# Altium project USB.PrjPcb
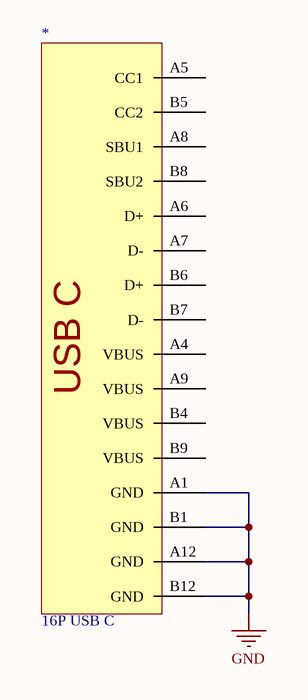
[diagram p0: USB.SchDoc]
3 sheets, 1 parts. Net scope: global (net labels, ports and power ports of the same name join across sheets).
Board file: USB_PCB.PcbDoc
Sheets:
  USB.SchDoc
  MUX.SchDoc
  STM32.SchDoc

## Sheet USB.SchDoc
size A; SheetNumber: 1; SheetTotal: 3

### Parts
*  16P USB C

### Nets
GND: *.A1(GND) *.A12(GND) *.B1(GND) *.B12(GND)

Not connected (* = marked no-connect by the designer): * A4(VBUS) A5(CC1) A6(D+) A7(D-) A8(SBU1) A9(VBUS) B4(VBUS) B5(CC2) B6(D+) B7(D-) B8(SBU2) B9(VBUS)

### Notes on the sheet
- (in symbol 16P USB C) USB C

### Library data of the parts
* = 16P USB C: USB - C Receptacle Connector 16 Position smt; Manufacturer: risym; Manufacturer Part Number: TYPE-CF-16P-OT1.6-L6.5; Number of Contacts: 16; Number of Ports: 1; Current Rating: 1.25A; Mating Cycles: 10000; Shielding: Shielded; Supplier 1: Taobao; RoHS: Yes; Category: USB Connectors; Stock 1: 51; Pricing 1: 1=2.35000, 10=2.13200, 25=2.00120, 50=1.91400, 100=1.82700, 250=1.65300, 500=1.52250 (USD); Mount: Surface Mount,Through Hole,Edge; Contact Plating: Gold; Insulation Color: Black; Min Operating Temperature: -30°C; Max Operating Temperature: 85°C; Connector Type: USB; Packaging: Cut Tape; Gender: Receptacle; Termination: Solder; Flammability Rating: UL94 V-0; ComponentLink1URL: https://detail.tmall.com/item.htm?spm=a230r.1.14.18.7d6e4118kTAdgq&id=580366058155&ns=1&abbucket=14&skuId=4243337440031; ComponentLink1Description: TYPE-CF-16P-OT1.6-L6.5; Supplier Part Number 1: H126318CT-ND

## Sheet MUX.SchDoc
size A; SheetNumber: 2; SheetTotal: 2

## Sheet STM32.SchDoc
size A; SheetNumber: 3; SheetTotal: 3